# EAGLE schematic Gambar Teknik (2) _Raihansyah Akbar M._21507334077_ (EAGLE 9.6.2)
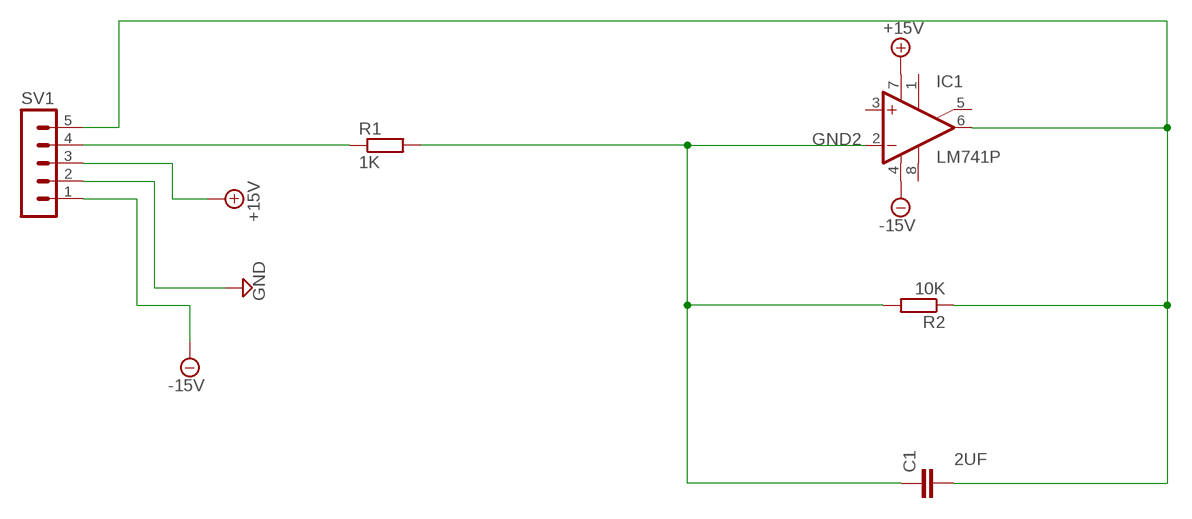
[diagram p0: schematic, sheet 1]

## Parts
C1  C-EU025-024X044  [C025-024X044]
IC1  LM741P  [DIL08]
R1  1K  R-EU_0204/2V  [0204V]
R2  10K  R-EU_0204/2V  [0204V]
SV1  MA05-1  [MA05-1]

## Nets
2UF: C1.2 IC1.6(OUT) R2.1 SV1.5
+15V: IC1.7(V+) SV1.3
-15V: IC1.4(V-) SV1.1
GND: SV1.2
GND2: C1.1 IC1.2(-IN) R1.2 R2.2
N$3: R1.1 SV1.4
Unconnected: IC1.1(ON1) IC1.3(+IN) IC1.5(ON2) IC1.8(OPT)

## Library data of the parts
C1 = rcl:C-EU: CAPACITOR, European symbol; SPICEPREFIX: C
IC1 = linear:*741: OP AMP
R1 R2 = rcl:R-EU_: RESISTOR, European symbol; SPICEPREFIX: R
SV1 = con-lstb:MA05-1: PIN HEADER; OC_FARNELL: unknown; OC_NEWARK: unknown